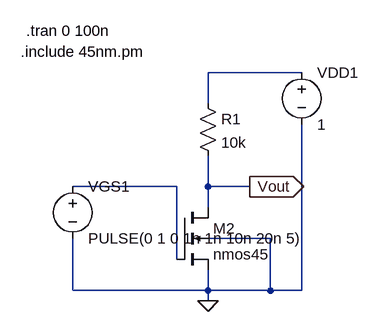
[diagram p0: schematic postlab1.asc]
postlab1.asc, the LTspice schematic file:
Version 4.1
SHEET 1 880 680
WIRE -128 -96 -272 -96
WIRE -272 -48 -272 -96
WIRE -320 80 -480 80
WIRE -272 80 -272 32
WIRE -208 80 -272 80
WIRE -272 112 -272 80
WIRE -176 160 -272 160
WIRE -320 192 -320 80
WIRE -480 240 -480 160
WIRE -272 240 -272 208
WIRE -272 240 -480 240
WIRE -176 240 -176 160
WIRE -176 240 -272 240
WIRE -128 240 -128 -16
WIRE -128 240 -176 240
WIRE -272 256 -272 240
FLAG -272 256 0
FLAG -208 80 Vout
IOPIN -208 80 Out
SYMBOL nmos4 -320 112 R0
SYMATTR InstName M2
SYMATTR Value2 l=45nm w=1u
SYMATTR Value nmos45
SYMBOL voltage -128 -112 R0
WINDOW 123 0 0 Left 0
WINDOW 39 0 0 Left 0
SYMATTR InstName VDD1
SYMATTR Value 1
SYMBOL voltage -480 64 R0
WINDOW 123 0 0 Left 0
WINDOW 39 0 0 Left 0
SYMATTR InstName VGS1
SYMATTR Value PULSE(0 1 0 1n 1n 10n 20n 5)
SYMBOL res -288 -64 R0
SYMATTR InstName R1
SYMATTR Value 10k
TEXT -560 -128 Left 2 !.include 45nm.pm
TEXT -552 -160 Left 2 !.tran 0 100n

The netlist it stands for:
* postlab1.asc
M2 Vout N002 0 0 nmos45 l=45nm w=1u
VDD1 N001 0 1
VGS1 N002 0 PULSE(0 1 0 1n 1n 10n 20n 5)
R1 N001 Vout 10k
.model NMOS NMOS
.model PMOS PMOS
.lib standard.mos
.include 45nm.pm
.tran 0 100n
.backanno
.end